# Altium schematic sheet FTDI_Interface.SchDoc
size A
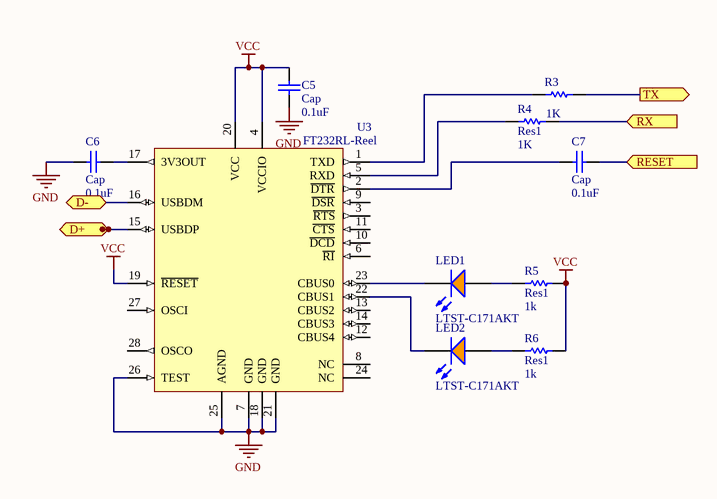
[diagram p0: FTDI_Interface.SchDoc]

## Parts
C5  Cap  value 0.1uF  [C0805]
C6  Cap  value 0.1uF  [C0805]
C7  Cap  value 0.1uF  [C0805]
LED1  LTST-C171AKT  [LTST-C171AKT_V]
LED2  LTST-C171AKT  [LTST-C171AKT_V]
R3  value 1K  [6-0805_L]  (hidden comment: Res1)
R4  Res1  value 1K  [6-0805_L]
R5  Res1  value 1k  [6-0805_L]
R6  Res1  value 1k  [6-0805_L]
U3  FT232RL-Reel  [SSOP-28_L]

## Ports
D+ (bidir), D- (bidir), RESET (in), RX (in), TX (out)

## Nets
GND: C5.1 C6.1 U3.7(GND) U3.18(GND) U3.21(GND) U3.25(AGND) U3.26(TEST)
VCC: C5.2 R5.2 R6.2 U3.4(VCCIO) U3.19(~{RESET}) U3.20(VCC)
D+: U3.15(USBDP) ; port D+
D-: U3.16(USBDM) ; port D-
RESET: C7.1 ; port RESET
RX: R4.2 ; port RX
TX: R3.2 ; port TX
NetC6_2: C6.2 U3.17(3V3OUT)
NetC7_2: C7.2 U3.2(~{DTR})
NetLED1_1: LED1.1(A) R5.1
NetLED1_2: LED1.2(K) U3.23(CBUS0)
NetLED2_1: LED2.1(A) R6.1
NetLED2_2: LED2.2(K) U3.22(CBUS1)
NetR3_1: R3.1 U3.1(TXD)
NetR4_1: R4.1 U3.5(RXD)

Not connected (* = marked no-connect by the designer): U3 3(~{RTS}) 6(~{RI}) 8(NC) 9(~{DSR}) 10(~{DCD}) 11(~{CTS}) 12(CBUS4) 13(CBUS2) 14(CBUS3) 24(NC) 27(OSCI) 28(OSCO)

## Library data of the parts
C5-C7 = Cap: Capacitor; Published: 8-Jun-2000; LatestRevisionDate: 17-Jul-2002; LatestRevisionNote: Re-released for DXP Platform.; PackageReference: RAD-0.3; Publisher: Altium Limited; PackageDescription: Radial Cap, Thru-Hole; 2 Leads; 0.3 in Pin Spacing
LED1 LED2 = CMP-1674-00004-5: LED Uni-Color Orange, 100 mW, 120 mA, -55 to 85 degC, 2-Pin SMD, RoHS, Tape and Reel; Manufacturer: Lite-On; ComponentLink1URL: http://www.us.liteon.com/; ComponentLink2Description: Datasheet; Packaging: Tape and Reel; Mount: Surface Mount; RoHSCompliant: true; Colour: Orange; Min Operating Temperature: -55 degC; ComponentLink2URL: http://optoelectronics.liteon.com/upload/download/DS-22-99-0170/S_110_LTST-C171AKT.pdf; Package Quantity: 3000; Height: 0.8 mm; Max Operating Temperature: 85 degC; ComponentLink1Description: Manufacturer URL; PackageReference: C171AKT; PackageDescription: 2-Pin Surface Mount Device, Body 2 x 1.25 mm; DatasheetVersion: 03/2014; Length: 2 mm; Mounting Technology: Surface Mount; Pins: 2
R3-R6 = Res1: Resistor; Published: 8-Jun-2000; LatestRevisionDate: 17-Jul-2002; LatestRevisionNote: Re-released for DXP Platform.; PackageReference: AXIAL-0.3; Publisher: Altium Limited; PackageDescription: Axial Device, Thru-Hole; 2 Leads; 0.3 in Pin Spacing
U3 = CMP-0078-00029-3: USB UART Asynchronous Serial Data Transfer Chip, 28-pin SSOP, Tape and Reel; Manufacturer: FTDI; PackageVersion: Mar-12; PackageReference: SSOP-28; ComponentLink2Description: Datasheet; DatasheetVersion: ver 2.10, Mar-2012; PackageDescription: 28-Pin Small Outline Package 0.65 mm Pitch; ComponentLink1Description: Manufacturer URL; RevisionNote: DatasheetVersion updated to 2.10 Mar-2012; PartNumber: FT232RL-Reel; ComponentLink1URL: http://www.ftdichip.com/; ComponentLink2URL: http://www.ftdichip.com/Support/Documents/DataSheets/ICs/DS_FT232R.pdf